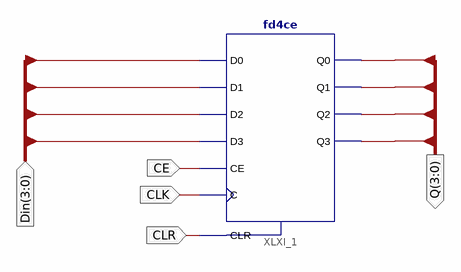
[diagram p0: schematic sheet 1]
// Xilinx ISE schematic wrappedFD4CE.sch (spartan3e) as structural Verilog: 1 symbols, 5 ports
module wrappedFD4CE (
  input  [3:0] Din,
  input  CE,
  input  CLK,
  input  CLR,
  output [3:0] Q
);

  fd4ce XLXI_1 (
    .C(CLK), .CE(CE), .CLR(CLR), .D0(Din[0]), .D1(Din[1]), .D2(Din[2]), .D3(Din[3]), .Q0(Q[0]), .Q1(Q[1]),
    .Q2(Q[2]), .Q3(Q[3]));
endmodule
